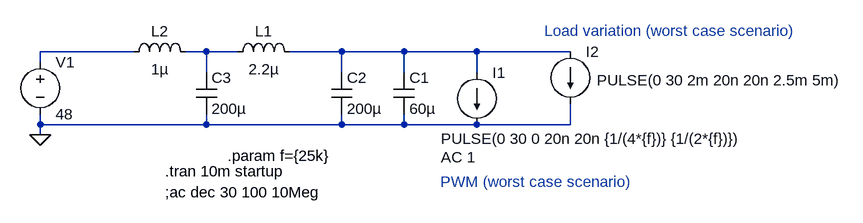
[diagram p0: schematic filter_sim.asc]
filter_sim.asc, the LTspice schematic file:
Version 4
SHEET 1 880 680
WIRE -688 176 -832 176
WIRE -576 176 -608 176
WIRE -528 176 -576 176
WIRE -368 176 -448 176
WIRE -272 176 -368 176
WIRE -160 176 -272 176
WIRE -16 176 -160 176
WIRE -832 192 -832 176
WIRE -576 208 -576 176
WIRE -368 208 -368 176
WIRE -272 208 -272 176
WIRE -160 208 -160 176
WIRE -832 288 -832 272
WIRE -576 288 -576 272
WIRE -576 288 -832 288
WIRE -368 288 -368 272
WIRE -368 288 -576 288
WIRE -272 288 -272 272
WIRE -272 288 -368 288
WIRE -160 288 -272 288
WIRE -16 288 -16 256
WIRE -16 288 -160 288
WIRE -832 304 -832 288
FLAG -832 304 0
SYMBOL current -160 208 R0
WINDOW 3 -55 102 Left 2
WINDOW 123 -55 130 Left 2
WINDOW 39 0 0 Left 0
SYMATTR Value PULSE(0 30 0 20n 20n {1/(4*{f})} {1/(2*{f})})
SYMATTR Value2 AC 1
SYMATTR InstName I1
SYMBOL cap -288 208 R0
SYMATTR InstName C1
SYMATTR Value 60µ
SYMBOL cap -384 208 R0
SYMATTR InstName C2
SYMATTR Value 200µ
SYMATTR SpiceLine Rser=1
SYMBOL ind -544 192 R270
WINDOW 0 32 56 VTop 2
WINDOW 3 5 56 VBottom 2
SYMATTR InstName L1
SYMATTR Value 2.2µ
SYMBOL voltage -832 176 R0
WINDOW 123 0 0 Left 0
WINDOW 39 0 0 Left 0
SYMATTR InstName V1
SYMATTR Value 48
SYMBOL cap -592 208 R0
SYMATTR InstName C3
SYMATTR Value 200µ
SYMATTR SpiceLine Rser=60m
SYMBOL ind -704 192 R270
WINDOW 0 32 56 VTop 2
WINDOW 3 5 56 VBottom 2
SYMATTR InstName L2
SYMATTR Value 1µ
SYMBOL current -16 176 R0
WINDOW 3 41 44 Left 2
WINDOW 123 0 0 Left 0
WINDOW 39 0 0 Left 0
SYMATTR Value PULSE(0 30 2m 20n 20n 2.5m 5m)
SYMATTR InstName I2
TEXT -544 336 Left 2 !.param f={25k}
TEXT -640 360 Left 2 !.tran 10m startup
TEXT -640 392 Left 2 !;ac dec 30 100 10Meg
TEXT -216 376 Left 2 ;PWM (worst case scenario)
TEXT -56 144 Left 2 ;Load variation (worst case scenario)

The netlist it stands for:
* filter_sim.asc
I1 N003 0 PULSE(0 30 0 20n 20n {1/(4*{f})} {1/(2*{f})}) AC 1
C1 N003 0 60µ
C2 N003 0 200µ Rser=1
L1 N002 N003 2.2µ
V1 N001 0 48
C3 N002 0 200µ Rser=60m
L2 N001 N002 1µ
I2 N003 0 PULSE(0 30 2m 20n 20n 2.5m 5m)
.param f={25k}
.tran 10m startup
;ac dec 30 100 10Meg
* PWM (worst case scenario)
* Load variation (worst case scenario)
.backanno
.end